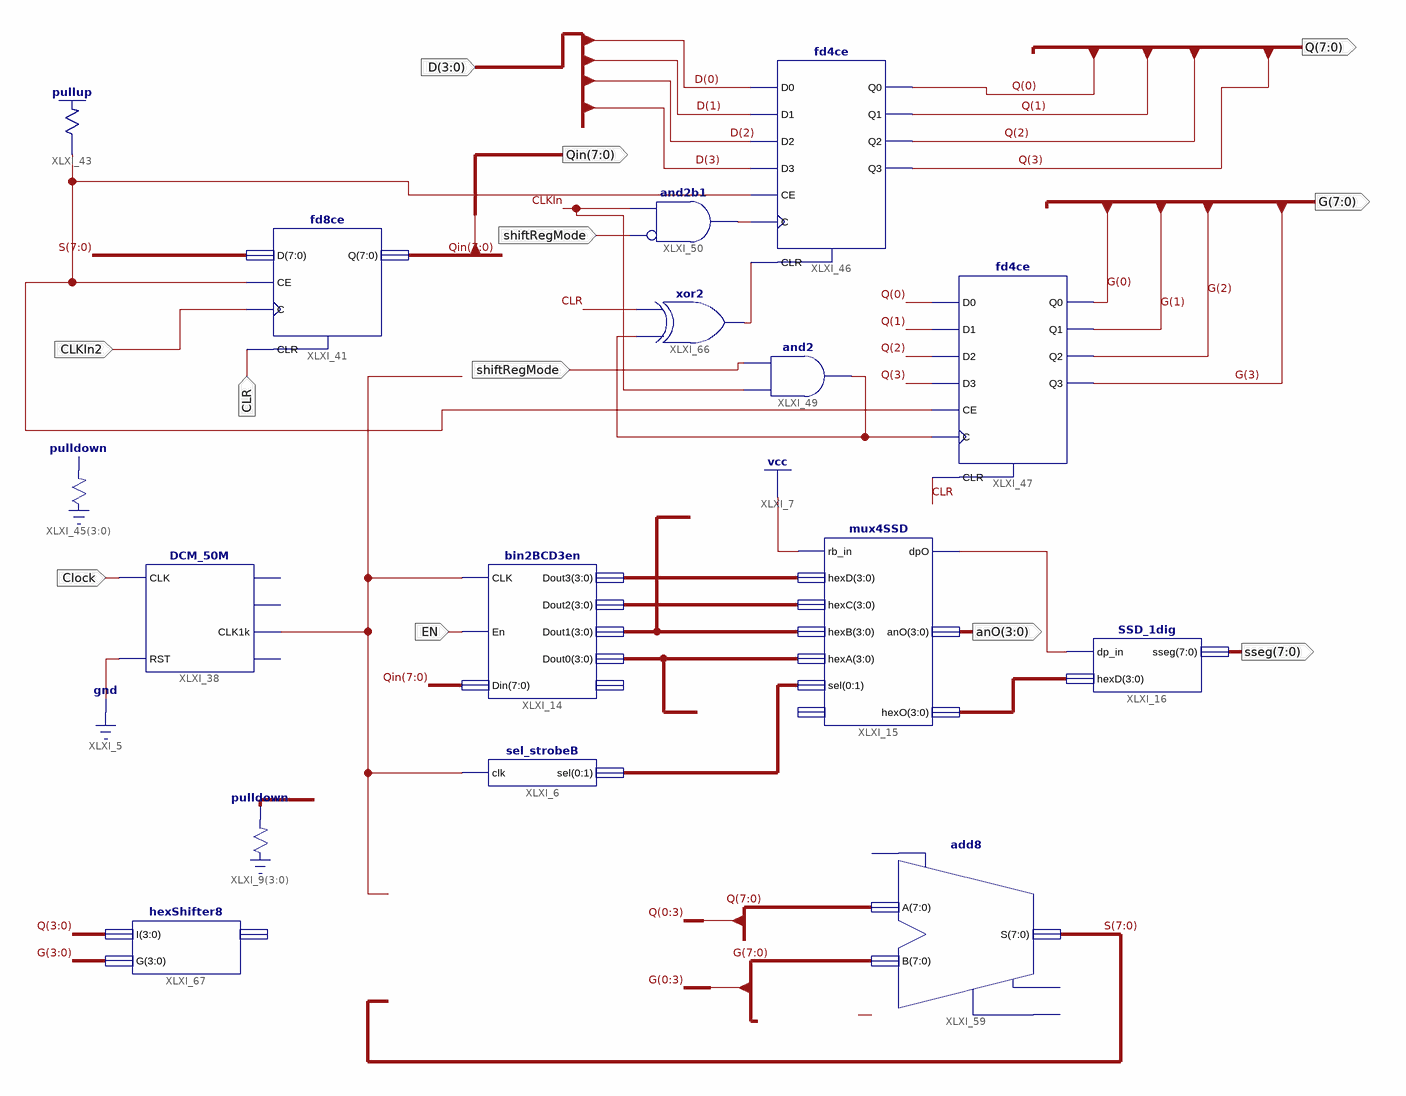
[diagram p0: schematic sheet 1]
// Xilinx ISE schematic test_shiftReg.sch (spartan3e) as structural Verilog: 16 symbols, 12 ports
module test_shiftReg (
  input  Clock,
  input  CLR,
  input  CLKIn,
  input  shiftRegMode,
  input  [3:0] D,
  input  CLKIn2,
  input  EN,
  output [7:0] sseg,
  output [3:0] anO,
  output [7:0] Q,
  output [7:0] Qin,
  output [7:0] G
);

  wire XLXN_86, XLXN_97, XLXN_131, XLXN_177, XLXN_178, XLXN_180;
  wire [1:0] XLXN_15;
  wire [3:0] XLXN_6, XLXN_13, XLXN_103, XLXN_163, XLXN_164;
  wire [7:0] S;
  wire [7:4] Dout;

  sel_strobeB XLXI_6 (.clk(XLXN_97), .sel({XLXN_15[0], XLXN_15[1]}));
  bin2BCD3en XLXI_14 (
    .CLK(XLXN_97), .En(EN), .Din(Qin), .Dout3(XLXN_164), .Dout2(XLXN_163), .Dout1(XLXN_103), .Dout0(XLXN_6));  // open: RBout
  mux4SSD XLXI_15 (
    .rb_in(1'b1), .hexD(XLXN_164), .hexC(XLXN_163), .hexB(XLXN_103), .hexA(XLXN_6),
    .sel({XLXN_15[0], XLXN_15[1]}), .dpO(XLXN_86), .anO(anO), .hexO(XLXN_13));  // open: dp_in
  SSD_1dig XLXI_16 (.dp_in(XLXN_86), .hexD(XLXN_13), .sseg(sseg));
  \pulldown  XLXI_9[3:0] (.O(Dout));
  DCM_50M XLXI_38 (.CLK(Clock), .RST(1'b0), .CLK1k(XLXN_97));  // open: CLK1M, CLK10k, CLK1
  fd8ce XLXI_41 (.C(CLKIn2), .CE(XLXN_180), .CLR(CLR), .D(S), .Q(Qin));
  \pullup  XLXI_43 (.O(XLXN_180));
  \pulldown  XLXI_45[3:0] ();  // open: O
  fd4ce XLXI_46 (
    .C(XLXN_131), .CE(XLXN_180), .CLR(XLXN_177), .D0(D[0]), .D1(D[1]), .D2(D[2]), .D3(D[3]), .Q0(Q[0]),
    .Q1(Q[1]), .Q2(Q[2]), .Q3(Q[3]));
  fd4ce XLXI_47 (
    .C(XLXN_178), .CE(XLXN_180), .CLR(CLR), .D0(Q[0]), .D1(Q[1]), .D2(Q[2]), .D3(Q[3]), .Q0(G[0]), .Q1(G[1]),
    .Q2(G[2]), .Q3(G[3]));
  and XLXI_49 (XLXN_178, CLKIn, shiftRegMode);
  and XLXI_50 (XLXN_131, ~shiftRegMode, CLKIn);  // and2b1
  add8 XLXI_59 (.A(Q), .B(G), .S(S));  // open: CI, CO, OFL
  xor XLXI_66 (XLXN_177, XLXN_178, CLR);
  hexShifter8 XLXI_67 (.I(Q[3:0]), .G(G[3:0]));  // open: hexO
endmodule
